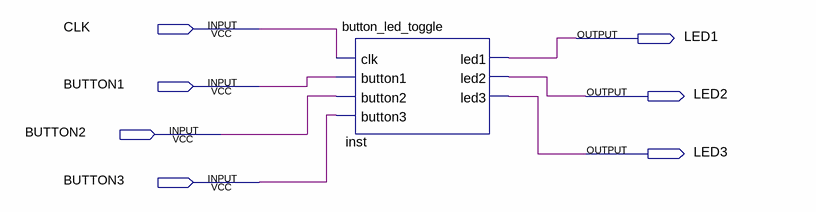
[diagram p0: schematic sheet]
// Quartus schematic Independent_LED_Toggle_with_Push_Buttons.bdf as structural Verilog: 1 symbols, 7 pins
module Independent_LED_Toggle_with_Push_Buttons (
  input  CLK,
  input  BUTTON1,
  input  BUTTON2,
  input  BUTTON3,
  output LED1,
  output LED2,
  output LED3
);

  button_led_toggle inst (
    .clk(CLK), .button1(BUTTON1), .button2(BUTTON2), .button3(BUTTON3), .led1(LED1), .led2(LED2), .led3(LED3));
endmodule
